# EAGLE design Arduino Nano2 (EAGLE 5.11)
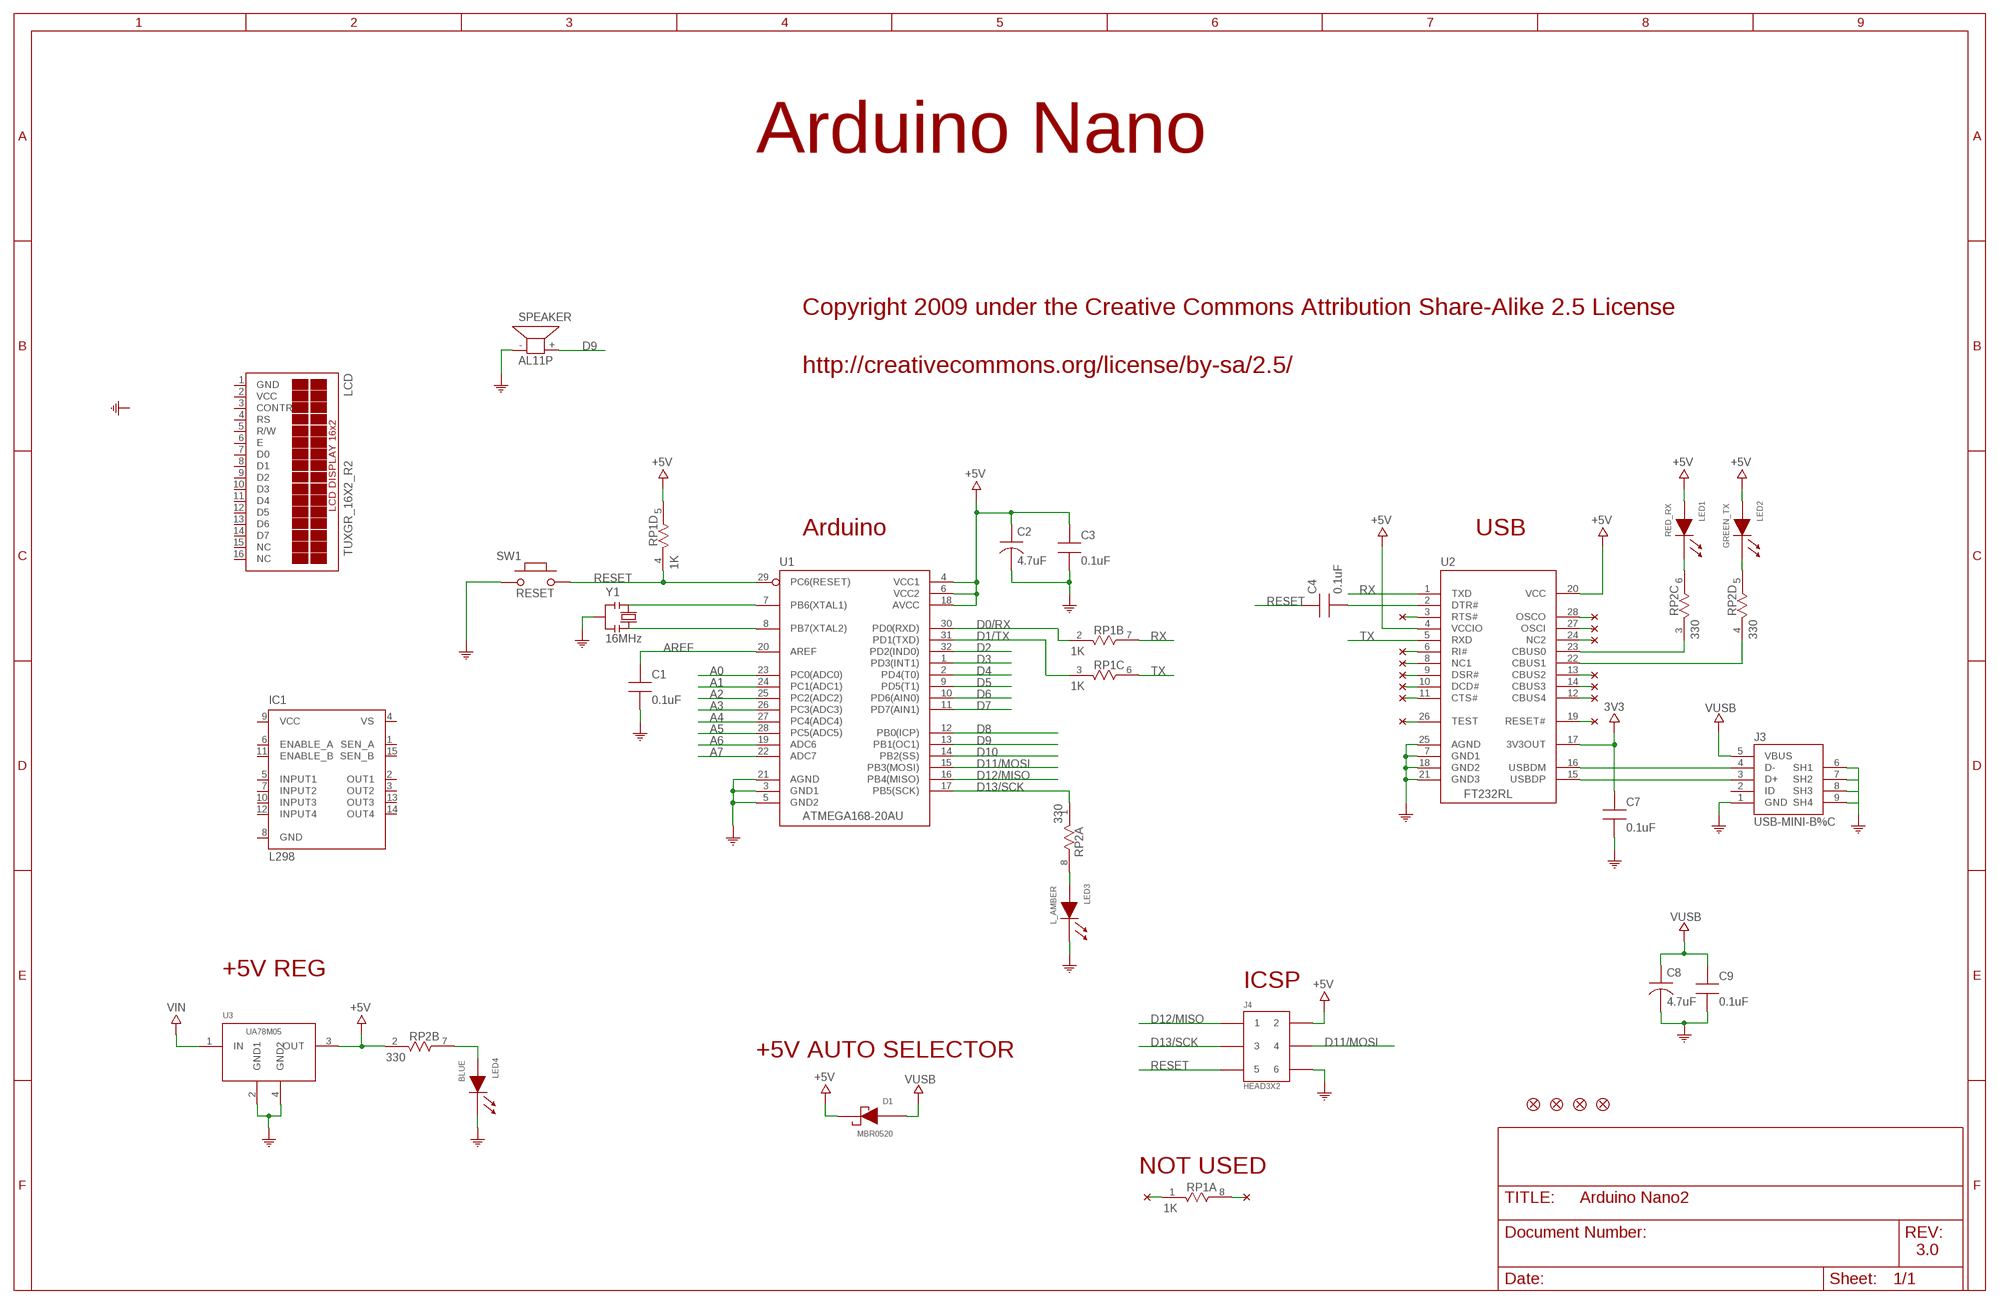
[diagram p0: schematic, sheet 1]

## Parts
C1  0.1uF  CAP0805-NP  [CAP0805-NP]
C2  4.7uF  CAP-TANA-P  [TAN-A]
C3  0.1uF  CAP0805-NP  [CAP0805-NP]
C4  0.1uF  CAP0805-NP  [CAP0805-NP]
C7  0.1uF  CAP0805-NP  [CAP0805-NP]
C8  4.7uF  CAP-TANA-P  [TAN-A]
C9  0.1uF  CAP0805-NP  [CAP0805-NP]
D1  MBR0520  [SOD-123]
IC1  L298  [MULTIWATT-15]
J3  USB-MINI-B%C  [USB-MINI-B_2]
J4  HEAD3X2  [HEAD3X2]
LCD  TUXGR_16X2_R2  [TUXGR_16X2_R2]
LED1  RED_RX  LED0805  [LED0805]
LED2  GREEN_TX  LED0805  [LED0805]
LED3  L_AMBER  LED0805  [LED0805]
LED4  BLUE  LED0805  [LED0805]
RP1  1K  RES4NT  [RES4NT]
RP2  330  RES4NT  [RES4NT]
SPEAKER  AL11P  [AL11P]
SW1  RESET  PB157  [157SW]
U1  ATMEGA168-20AU  [QFP032]
U2  FT232RL  [SSOP28]
U3  UA78M05  [SOT223]
U$4  FIDUCIAL1X2  [FIDUCIAL-1X2]
U$37  FIDUCIAL1X2  [FIDUCIAL-1X2]
U$53  FIDUCIAL1X2  [FIDUCIAL-1X2]
U$54  FIDUCIAL1X2  [FIDUCIAL-1X2]
Y1  16MHz  RESONATORMU  [RESONATOR]

## Nets
3V3: C7.1 U2.17(3V3OUT)
+5V: C2.1 C3.1 D1.1(CA) J4.2 LED1.2(AN) LED2.2(AN) RP1.5 RP2.2 U1.4(VCC1) U1.6(VCC2) U1.18(AVCC) U2.4(VCCIO) U2.20(VCC) U3.3(OUT)
A0: U1.23(PC0(ADC0))
A1: U1.24(PC1(ADC1))
A2: U1.25(PC2(ADC2))
A3: U1.26(PC3(ADC3))
A4: U1.27(PC4(ADC4))
A5: U1.28(PC5(ADC5))
A6: U1.19(ADC6)
A7: U1.22(ADC7)
AREF: C1.1 U1.20(AREF)
COM: C1.2 C2.2 C3.2 C7.2 C8.2 C9.2 J3.1(GND) J3.6(SH1) J3.7(SH2) J3.8(SH3) J3.9(SH4) J4.6 LED3.1(CA) LED4.1(CA) SPEAKER.- SW1.1 U1.3(GND1) U1.5(GND2) U1.21(AGND) U2.7(GND1) U2.18(GND2) U2.21(GND3) U2.25(AGND) U3.2(GND1) U3.4(GND2) Y1.2
D0/RX: RP1.2 U1.30(PD0(RXD))
D1/TX: RP1.3 U1.31(PD1(TXD))
D2: U1.32(PD2(IND0))
D3: U1.1(PD3(INT1))
D4: U1.2(PD4(T0))
D5: U1.9(PD5(T1))
D6: U1.10(PD6(AIN0))
D7: U1.11(PD7(AIN1))
D8: U1.12(PB0(ICP))
D9: SPEAKER.+ U1.13(PB1(OC1))
D10: U1.14(PB2(SS))
D11/MOSI: J4.4 U1.15(PB3(MOSI))
D12/MISO: J4.1 U1.16(PB4(MISO))
D13/SCK: J4.3 RP2.1 U1.17(PB5(SCK))
N$1: U1.8(PB7(XTAL2)) Y1.3
N$2: U1.7(PB6(XTAL1)) Y1.1
N$3: LED4.2(AN) RP2.7
N$4: C4.2 U2.2(DTR#)
N$5: J3.3(D+) U2.15(USBDP)
N$6: J3.4(D-) U2.16(USBDM)
N$7: LED3.2(AN) RP2.8
N$8: RP2.3 U2.23(CBUS0)
N$9: RP2.4 U2.22(CBUS1)
N$10: LED1.1(CA) RP2.6
N$11: LED2.1(CA) RP2.5
N$12: U2.11(CTS#)
N$13: U2.6(RI#)
N$14: U2.8(NC1)
N$15: U2.9(DSR#)
N$16: U2.10(DCD#)
N$17: U2.28(OSCO)
N$18: U2.27(OSCI)
N$19: U2.24(NC2)
N$20: U2.13(CBUS2)
N$21: U2.14(CBUS3)
N$22: U2.12(CBUS4)
N$23: U2.19(RESET#)
N$24: RP1.1
N$25: RP1.8
N$26: U2.26(TEST)
N$27: U2.3(RTS#)
RESET: C4.1 J4.5 RP1.4 SW1.2 U1.29(PC6(RESET))
RX: RP1.7 U2.1(TXD)
TX: RP1.6 U2.5(RXD)
VIN: U3.1(IN)
VUSB: C8.1 C9.1 D1.2(AN) J3.5(VBUS)
Unconnected: IC1.1(SEN_A) IC1.2(OUT1) IC1.3(OUT2) IC1.5(INPUT1) IC1.6(ENABLE_A) IC1.7(INPUT2) IC1.10(INPUT3) IC1.11(ENABLE_B) IC1.12(INPUT4) IC1.13(OUT3) IC1.14(OUT4) IC1.15(SEN_B) J3.2(ID) LCD.3(CONTR) LCD.4(RS) LCD.5(R/W) LCD.6(E) LCD.7(D0) LCD.8(D1) LCD.9(D2) LCD.10(D3) LCD.11(D4) LCD.12(D5) LCD.13(D6) LCD.14(D7) LCD.15(NC) LCD.16(NC)

## Notes on the sheet
- Arduino Nano
- Copyright 2009 under the Creative Commons Attribution Share-Alike 2.5 License
- http://creativecommons.org/license/by-sa/2.5/
- Arduino | USB
- +5V REG
- ICSP
- +5V AUTO SELECTOR
- NOT USED
- 3.0

## Power pins joined to a net without a drawn wire
GND: IC1.8(GND) LCD.1(GND)
VCC: IC1.9(VCC) LCD.2(VCC)
VS: IC1.4(VS)

## Library data of the parts
C1 C3 C4 C7 C9 = MySMD:CAP0805-NP
C2 C8 = MySMD:CAP-TANA-P
D1 = MySMD:MBR0520
IC1 = st-microelectronics:L298: DUAL FULL-BRIDGE DRIVER; MPN: L298N; OC_FARNELL: 1589425; OC_NEWARK: 32M1527
J3 = MyCON2:USB-MINI-B
J4 = MyCON2:HEAD3X2
LCD = display-lcd:TUXGR_16X2_R2: Tuxgraphics LCD display 16x2 characters reflective, without background light Source: tuxgr_12x2_r2.pdf; OC_FARNELL: unknown; OC_NEWARK: unknown
LED1-LED4 = MySMD:LED0805
RP1 RP2 = MySMD:RES4NT
SPEAKER = buzzer:AL11P: SPEAKER Source: Buerklin; OC_FARNELL: unknown; OC_NEWARK: unknown
SW1 = MySMD:PB157
U1 = MySMD:ATMEGA168-20AU
U2 = MySMD2:FT232RL
U3 = MySMD:UA78M05
U$4 U$37 U$53 U$54 = SparkFun:FIDUCIAL: Fiducial Alignment Points Various fiducial points for machine vision alignment.
Y1 = MySMD2:RESONATOR

## Board
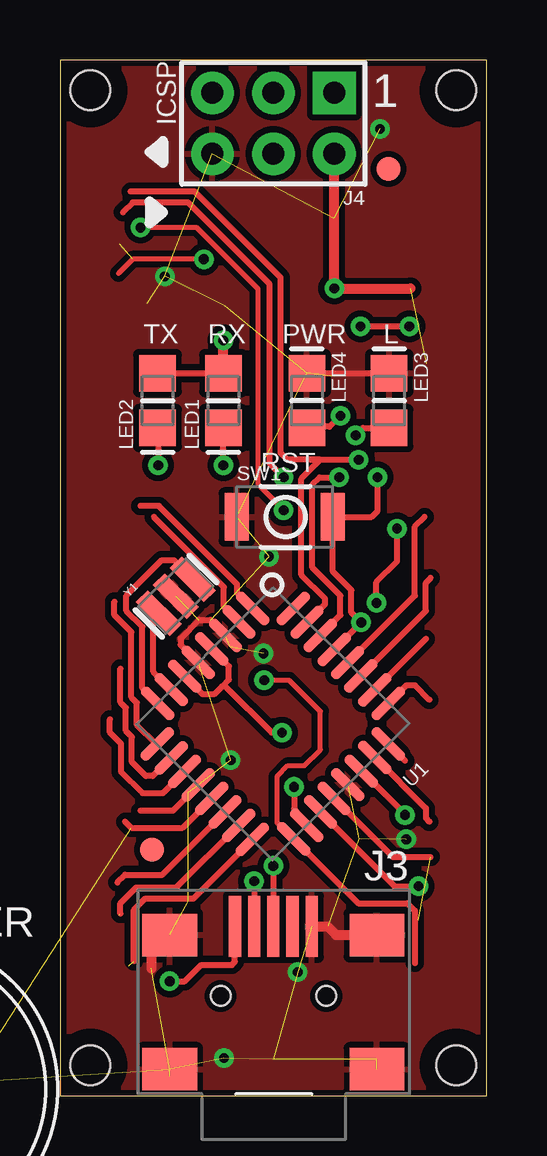
[diagram p1: board, top side]
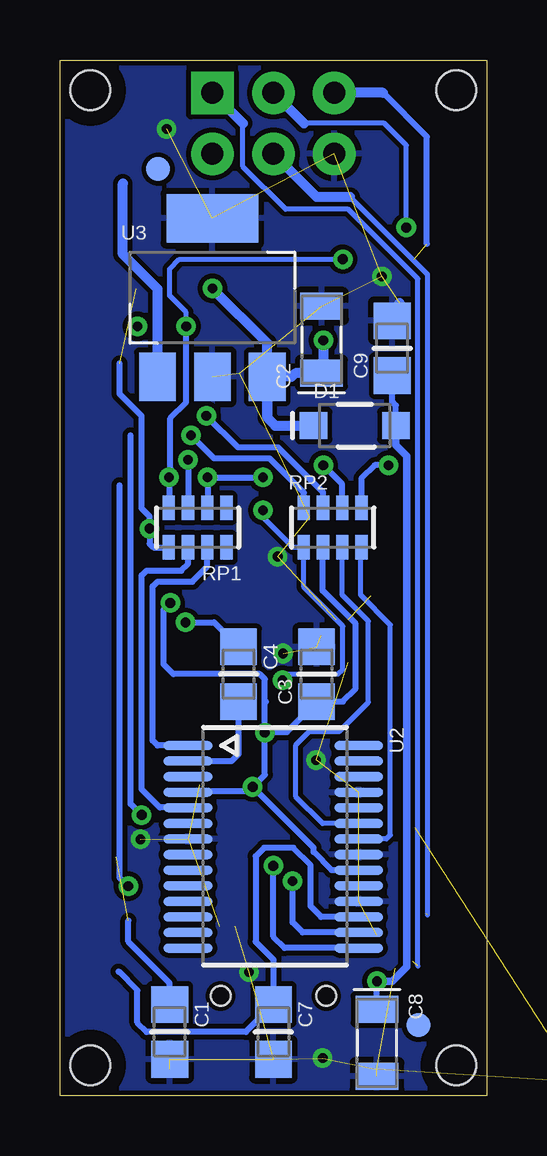
[diagram p2: board, bottom side, seen from below]

Size 17.78 x 43.18 mm. Coordinates in mm from the lower left corner, seen from the top.
Outline: 0,0 17.78,0 17.78,43.18 0,43.18 0,0
Copper layers (1*16): Top 0.035mm / dielectric 1.5mm / Bottom 0.035mm
Design rules "default *": minimum track width 8mil, minimum drill 16mil, track to track 8mil, track to pad 8mil, pad to pad 8mil, via to via 8mil, smd to smd 8mil, copper to edge 8mil, drill to drill 8mil, minimum pad ring 12mil, minimum via ring 8mil, stop-mask expansion 4mil, vias tented up to drill 18mil, thermal gap 10mil
Holes 1.65 mm at 1.27,1.27 16.51,1.27 16.51,41.91 1.27,41.91
tRestrict: area 0.1,0.1 to 2.4,2.4; area 15.4,40.8 to 17.7,43.1; area 15.4,0.1 to 17.7,2.4; area 0.1,40.8 to 2.4,43.1
bRestrict: area 15.4,0.1 to 17.7,2.4; area 0.1,0.1 to 2.4,2.4; area 0.1,40.8 to 2.4,43.1; area 15.4,40.8 to 17.7,43.1

### Footprints (pad centres in the part's own frame; a part is rotated, then mirrored left to right if it is on the bottom)
CAP0805-NP = smd 1.524 x 1.524: 1 0,0; 2 2.286,0
TAN-A = smd 1.118 x 1.778: 1 0,0; 2 2.794,0
SOD-123 = smd 1.143 x 1.143: 1 0,0; 2 3.429,0
MULTIWATT-15 = drill 1.2 long: 1 -8.89,-7.62; 2 -7.62,-2.54; 3 -6.35,-7.62; 4 -5.08,-2.54; 5 -3.81,-7.62; 6 -2.54,-2.54; 7 -1.27,-7.62; 8 0,-2.54; 9 1.27,-7.62; 10 2.54,-2.54; 11 3.81,-7.62; 12 5.08,-2.54; 13 6.35,-7.62; 14 7.62,-2.54; 15 8.89,-7.62
USB-MINI-B_2 = smd 0.508 x 2.54: 1 0,0; 2 0.8,0; 3 1.6,0; 4 2.4,0; 5 3.2,0 | smd 2.286 x 1.778: 6 -2.717,5.948; 7 -2.717,0.36; 8 5.918,0.36; 9 5.918,5.948 | hole 0.813: -0.6,2.9; 3.8,2.9
HEAD3X2 = drill 0.914 pad 1.778 square: 1 0,0 | drill 0.914 pad 1.778 round: 2 0,2.54; 3 2.54,0; 4 2.54,2.54; 5 5.08,0; 6 5.08,2.54
TUXGR_16X2_R2 = drill 1 pad 1.676 round: 1 -32,15.5; 2 -29.46,15.5; 3 -26.92,15.5; 4 -24.38,15.5; 5 -21.84,15.5; 6 -19.3,15.5; 7 -16.76,15.5; 8 -14.22,15.5; 9 -11.68,15.5; 10 -9.14,15.5; 11 -6.6,15.5; 12 -4.06,15.5; 13 -1.52,15.5; 14 1.02,15.5; 15 3.56,15.5; 16 6.1,15.5 | hole 2.5: -37.5,-15.5; 37.5,-15.5; -37.5,15.5; 37.5,15.5
LED0805 = smd 1.524 x 1.524: 1 0,0; 2 2.286,0
RES4NT = smd 0.508 x 1.016: 1 0,0; 2 0.8,0; 3 1.6,0; 4 2.4,0; 5 2.4,1.651; 6 1.6,1.651; 7 0.8,1.651; 8 0,1.651
AL11P = drill 1.016 pad 1.905 octagon: + 2.286,0; - -2.286,0
157SW = smd 1.016 x 1.981: 1 0,0; 2 4,0
QFP032 = smd 0.432 x 1.778: 1 0,0; 2 0.8,0; 3 1.599,0; 4 2.399,0; 5 3.199,0; 6 3.998,0; 7 4.798,0; 8 5.598,0; 17 5.588,8.001; 18 4.798,7.997; 19 3.998,7.997; 20 3.199,7.997; 21 2.399,7.997; 22 1.599,7.997; 23 0.799,7.997; 24 0,7.997 | smd 1.778 x 0.432: 9 6.807,1.194; 10 6.807,2.007; 11 6.807,2.794; 12 6.807,3.607; 13 6.807,4.394; 14 6.807,5.182; 15 6.807,5.994; 16 6.816,6.803; 25 -1.194,6.807; 26 -1.194,5.994; 27 -1.194,5.182; 28 -1.194,4.394; 29 -1.194,3.607; 30 -1.194,2.794; 31 -1.194,2.007; 32 -1.194,1.194
SSOP28 = smd 0.381 x 2.032: 1 0,0; 2 0.65,0; 3 1.3,0; 4 1.95,0; 5 2.6,0; 6 3.25,0; 7 3.9,0; 8 4.55,0; 9 5.2,0; 10 5.85,0; 11 6.5,0; 12 7.15,0; 13 7.8,0; 14 8.45,0; 15 8.45,7.112; 16 7.8,7.112; 17 7.15,7.112; 18 6.5,7.112; 19 5.85,7.112; 20 5.2,7.112; 21 4.55,7.112; 22 3.9,7.112; 23 3.25,7.112; 24 2.6,7.112; 25 1.95,7.112; 26 1.3,7.112; 27 0.65,7.112; 28 0,7.112
SOT223 = smd 1.524 x 2.032: 1 0,0; 2 2.286,0; 3 4.572,0 | smd 3.81 x 2.032: 4 2.286,6.604
FIDUCIAL-1X2 = smd 1 x 1: 1 0,0
RESONATOR = smd 0.7 x 2: 1 -1,0; 2 0,0; 3 1,0

### Placement (x,y rotation side)
C1  13.21,3.81 270 bottom
C2  6.88,30.12 90 bottom
C3  7.09,16.43 90 bottom
C4  10.34,18.72 270 bottom
C7  8.89,3.81 270 bottom
C8  4.57,3.61 270 bottom
C9  3.94,30.02 90 bottom
D1  7.21,27.94 0 bottom
IC1  -3.02,-47.14 0 top  (outside the outline)
J3  10.49,7.06 180 top
J4  11.43,41.81 180 top
LCD  27.15,-26.44 0 top  (outside the outline)
LED1  6.81,27.84 90 top
LED2  4.06,27.84 90 top
LED3  13.72,30.12 270 top
LED4  10.29,30.12 270 top
RP1  10.85,24.51 180 bottom
RP2  7.62,22.86 0 bottom
SPEAKER  -6.32,0.28 0 top  (outside the outline)
SW1  7.37,24.13 0 top
U1  8.03,20.32 225 top
U2  12.45,14.61 270 bottom
U3  13.72,29.97 0 bottom
U$4  13.69,38.63 0 top
U$37  3.84,10.26 0 top
U$53  13.69,38.63 0 bottom
U$54  2.84,2.95 0 bottom
Y1  4.83,20.83 45 top

### Tracks (layer width: path | path; a pad name or v marks a point on that pad's centre or on a via)
3V3
  Bottom 0.254: 15.32,5.16 15.34,5.18 14.55,4.39 14.55,3.05 14.17,2.67 10.03,2.67 C7.1 8.91,3.83 8.89,3.86 8.89,5.69 9.63,6.43 9.63,9.98 9.27,10.34 8.05,10.34 7.34,9.63 7.34,7.9 6.9,7.46 U2.17
+5V  (via drill 0.41, 0.41 pad 0.81)  (1 unrouted)
  Top 0.254: LED2.2 LED1.2 | v9.75,12.88 9.75,11.96 U1.18 | v13.18,20.55 13.18,21.41 14.05,22.28 v14.05,23.65 | U1.6 5.94,16.74 6.43,16.74 6.76,17.07 | 6.76,17.07 7.04,17.35 7.04,17.91 U1.4 | 6.76,17.07 6.88,17.07 8.81,15.14 v9.25,15.14
  Top 0.406: LED1.2 v6.81,31.5 | J4.2 v11.43,33.66 14.61,33.66
  Bottom 0.254: v9.75,12.88 9.93,12.7 11.46,12.7 U2.4 | v9.75,12.88 9.25,13.39 v9.25,15.14 | 9.25,16.46 9.25,17.37 9.45,17.58 13.06,17.58 13.46,17.98 13.46,20.27 v13.18,20.55 | 9.25,16.46 9.22,16.46 9.2,16.43 | U2.20 6.46,9.4 7.21,10.16 7.21,10.34 v9.75,12.88 | v9.25,15.14 9.25,16.46 | v9.25,15.14 9.22,15.16 8.33,15.16 7.09,16.41 C3.1 5.99,16.43 5.46,16.97 5.46,19.68 6.83,21.06 6.83,22.84 6.82,22.85 RP2.2 | RP1.5 13.89,22.86 14.05,23.01 v14.05,23.65 14.05,24.16 14.38,24.49 14.38,28.35 15.29,29.26 15.29,30.53
  Bottom 0.406: 9.14,28.27 U3.3 8.13,29.97 7.98,30.12 C2.1 6.88,30.15 6.81,30.23 v6.81,31.5 | D1.1 8.81,27.94 9.14,28.27 | 9.14,28.27 9.14,31.37 v11.43,33.66
A0
  Top 0.254: U1.23 15.24,11.99 15.24,11.58 15.39,11.43
A1
  Top 0.254: U1.24 | U1.24 14.38,13.97
A2
  Top 0.254: U1.25 | U1.25 14.45,17.12 14.78,17.12 15.39,16.51
A3
  Top 0.254: U1.26 15.24,19.05
A4
  Top 0.254: U1.27 12.53,17.51 15.24,20.22 15.24,21.39 15.44,21.59
A5
  Top 0.254: U1.28 14.78,20.85 14.78,23.72 15.19,24.13
A6  (via drill 0.41 pad 0.81)
  Top 0.254: U1.19 10.89,11.84 10.89,11.79 13.95,8.74 v14.94,8.74
  Bottom 0.254: 15.29,25.45 15.29,9.09 v14.94,8.74
A7  (via drill 0.41 pad 0.81)
  Top 0.254: v14.38,11.71 14.38,11.73 12.58,13.53 U1.22
  Bottom 0.254: 14.83,27.53 14.83,12.17 v14.38,11.71
AREF  (1 unrouted)
  Top 0.254: U1.20 13.87,9.96 15.44,9.96
  Bottom 0.254: 14.94,7.32 14.94,6.43 13.21,4.7 C1.1
COM  (via drill 0.41, 0.41 pad 0.81)  (30 unrouted)
  Top 0.254: LED4.1 LED3.1 | U1.5 5.03,18.8 5.03,19.07 5.79,19.84 6.27,19.84 6.89,19.22 U1.3
  Top 0.406: J3.1 11.15,7.06 11.51,6.71 J3.7 | J3.8 3.81,6.7 3.81,5.31
  Bottom 0.406: 3.63,33.05 3.83,32.84 C9.2
  other vias: 13.34,40.31 6.83,1.57 9.91,5.16 14.43,10.69 8.48,18.44 8.71,22.48 7.11,14 4.37,34.16
  pour Top (isolate 0.254): 0.25,0.25 0.25,42.93 17.53,42.93 17.53,0.25
  pour Bottom (isolate 0.203): 0.25,0.25 0.25,42.93 17.53,42.93 17.53,0.25
D0/RX  (via drill 0.41 pad 0.81)
  Top 0.254: U1.30 10.85,19.2 11.68,20.04 11.68,20.85 10.52,22.02 10.52,25.48 10.82,25.78 v11.63,25.78 | v9.32,25.78 8.74,26.36 8.74,33.83 5.33,37.24 3.02,37.24 2.62,36.83
  Bottom 0.254: RP1.2 11.63,24.51 v11.63,25.78 v9.32,25.78
D1/TX  (via drill 0.41 pad 0.81)
  Top 0.254: U1.31 11.05,20.5 11.05,20.73 10.06,21.72 10.06,25.73 10.85,26.52 | 10.49,26.52 10.44,26.52 | 10.85,26.52 v12.45,26.52 | 10.85,26.52 10.49,26.52 | 10.49,26.52 9.47,26.52 9.2,26.8 9.2,34.11 5.61,37.69 2.95,37.69
  Bottom 0.254: v12.45,26.52 RP1.3
D3
  Top 0.254: U1.1 7.37,20.98 7.37,21.34 4.12,24.59 3.35,24.59
D4
  Top 0.254: U1.2 7.46,19.77 6.83,20.4 6.83,21.21 3.91,24.13
D5
  Top 0.254: U1.9 4.01,14.66 3.2,15.47 3.2,16.38 2.97,16.61 2.97,19.33 2.26,20.04 2.26,20.6
D6
  Top 0.254: U1.10 4.61,14.09 3.86,13.34 3.58,13.34 3,13.92 3,14.96 2.74,15.21 2.74,16.18 2.52,16.41 2.52,17.8
D7
  Top 0.254: U1.11 4.29,12.62 3.43,12.62 2.54,13.51 2.54,14.68 2.08,15.14 2.08,15.7
D8
  Top 0.254: U1.12 4.7,11.89 3.35,11.89
D9  (1 unrouted)
  Top 0.254: U1.13 5.11,11.18 2.97,11.18 2.72,11.43 | U1.13
D10
  Top 0.254: U1.14 4.27,9.22 2.72,9.22 2.39,8.89 | U1.14
D11/MOSI  (1 unrouted)
  Top 0.254: U1.15 4.85,8.69 3.17,8.69 2.52,8.03 2.52,7.59 | U1.15
  Bottom 0.203: 5.69,37.47 2.46,34.24 2.46,7.54
  Bottom 0.406: J4.4 7.09,37.47 5.69,37.47
D12/MISO  (1 unrouted)
  Top 0.254: U1.16 | U1.16 | U1.16 5.56,8.23 3.56,8.23 3.07,7.75 3.07,5.61
  Bottom 0.203: 10.16,40.54 10.16,38.73 8.38,36.96 5.77,36.96 2.87,34.06 2.87,5.41
  Bottom 0.406: 10.16,40.54 J4.1
D13/SCK  (via drill 0.41 pad 0.81)
  Top 0.203: U1.17 9.71,10.71 9.04,11.38 9.04,13.31 9.5,13.77 10.19,13.77 10.85,14.43 10.85,16.03 9.55,17.32 v8.51,17.32 | v3.35,36.2 5.69,36.2 8.26,33.63 8.26,25.48 v9.32,24.41
  Top 0.254: U1.17 12.42,8.03 14.48,8.03 14.78,7.72 14.78,5.54
  Bottom 0.203: v8.51,17.32 8.26,17.58 6.2,17.58 5.99,17.78 5.99,19.58 7.62,21.21 RP2.1 8.05,22.86 9.32,24.13 v9.32,24.41 | 7.62,40.54 4.27,40.54 3.35,39.62 v3.35,36.2
  Bottom 0.406: 7.62,40.54 J4.3
GND  (1 unrouted)
N$1
  Top 0.254: U1.8 4.07,16.38 4.04,16.38 3.43,16.99 3.43,19.56 2.77,20.22 2.77,20.85 4.24,22.33 4.75,22.33 Y1.3
N$2
  Top 0.254: U1.7 3.89,17.68 3.89,19.89 Y1.1
N$3  (via drill 0.41 pad 0.81)
  Top 0.254: LED4.2 10.34,27.84 10.39,27.89 11.23,27.89 v11.68,28.35
  Bottom 0.254: RP2.7 6.82,25.16 8.69,27.03 10.36,27.03 v11.68,28.35
N$4
  Bottom 0.254: U2.2 10.63,13.96 10.34,14.25 C4.2
N$5  (via drill 0.41 pad 0.81)
  Top 0.254: J3.3 8.89,9.45 v8.89,9.59
  Bottom 0.254: v8.89,9.59 8.89,6.63 8.42,6.16 5.35,6.16 U2.15
N$6  (via drill 0.41 pad 0.81)
  Top 0.254: J3.4 8.09,8.79 v8.09,8.95
  Bottom 0.254: v8.09,8.95 8.09,7.23 7.67,6.81 5.35,6.81 5.33,6.79 U2.16
N$7  (via drill 0.41 pad 0.81)
  Top 0.254: 13.74,27.84 LED3.2 12.62,27.84 v12.32,27.53
  Bottom 0.254: RP2.8 7.62,25.15 9.04,26.57 11.35,26.57 v12.32,27.53
N$8
  Bottom 0.203: U2.23 6.83,11.36 7.95,12.47 7.95,14.63 7.39,15.19 6.15,15.19 4.93,16.41 4.93,19.79 6.02,20.88 RP2.3
  Bottom 0.254: U2.23
N$9
  Bottom 0.203: U2.22 4.18,10.71 4.01,10.87 4.01,19.63 5.26,20.88 5.26,22.84 5.23,22.86 RP2.4
N$10  (via drill 0.41 pad 0.81)
  Top 0.254: 6.81,27.86 LED1.1 v6.81,26.29
  Bottom 0.254: RP2.6 6.02,25.5 v6.81,26.29
N$11  (via drill 0.41 pad 0.81)
  Top 0.254: LED2.1 v4.09,26.29
  Bottom 0.254: RP2.5 5.22,25.74 4.67,26.29 v4.09,26.29
RESET  (via drill 0.41, 0.41 pad 0.81)  (1 unrouted)
  Top 0.203: v5.99,34.87 3.02,34.87 2.44,34.29
  Top 0.254: U1.29 v12.55,19.74 12.14,20.14 12.14,21.08 11.37,21.86 SW1.2 12.98,24.13 13.23,24.38 v13.23,25.78 | v12.52,32.08 v14.55,32.08
  Bottom 0.203: v12.52,32.08 12.52,32.66 13.21,33.35 13.21,34.47 12.8,34.87 v5.99,34.87
  Bottom 0.254: 12.42,19.61 v12.55,19.74 11.35,19.74 C4.1 | RP1.4 13.23,24.54 v13.23,25.78 13.18,26.16 13.18,28.25 12.52,28.91 v12.52,32.08 | v14.55,32.08 14.55,32.33 | 2.49,35.51 2.49,39.98 4.32,41.81
  Bottom 0.406: 4.32,41.81 J4.5
RX
  Bottom 0.254: RP1.7 11.65,22.06 12.27,21.44 13.72,21.44 13.92,21.23 13.92,14.81 13.72,14.61 U2.1
TX
  Bottom 0.254: RP1.6 12.45,22.17 12.72,21.89 14.17,21.89 14.38,21.69 14.38,12.78 13.61,12.01 12.45,12.01 U2.5
VCC  (1 unrouted)
VIN
  Bottom 0.406: U3.1 13.72,33.63 15.16,35.08 15.16,38.02
VUSB  (via drill 0.41 pad 0.81)
  Top 0.254: J3.5 7.29,5.59 7.16,5.46 5.89,5.46 5.21,4.78 v4.57,4.78
  Bottom 0.254: C8.1 v4.57,4.78 | D1.2 3.79,28.78 3.94,28.93 C9.1
  Bottom 0.305: v4.57,4.78 3.94,4.78 3.33,5.38 3.33,26.67 3.79,27.13 D1.2

### Text on the board
tPlace: 1 | ICSP | TX | RX | PWR | L | RST